# Altium schematic sheet Power_Supply.SchDoc
size A4; CompanyName: Technische Hochschule Nürnberg Georg Simon Ohm; Address1: Fürther Straße 250; Address2: 90429 Nürnberg; Address3: GERMANY; SheetNumber: 3; SheetTotal: 3; CompanyName2: Institut ELSYS
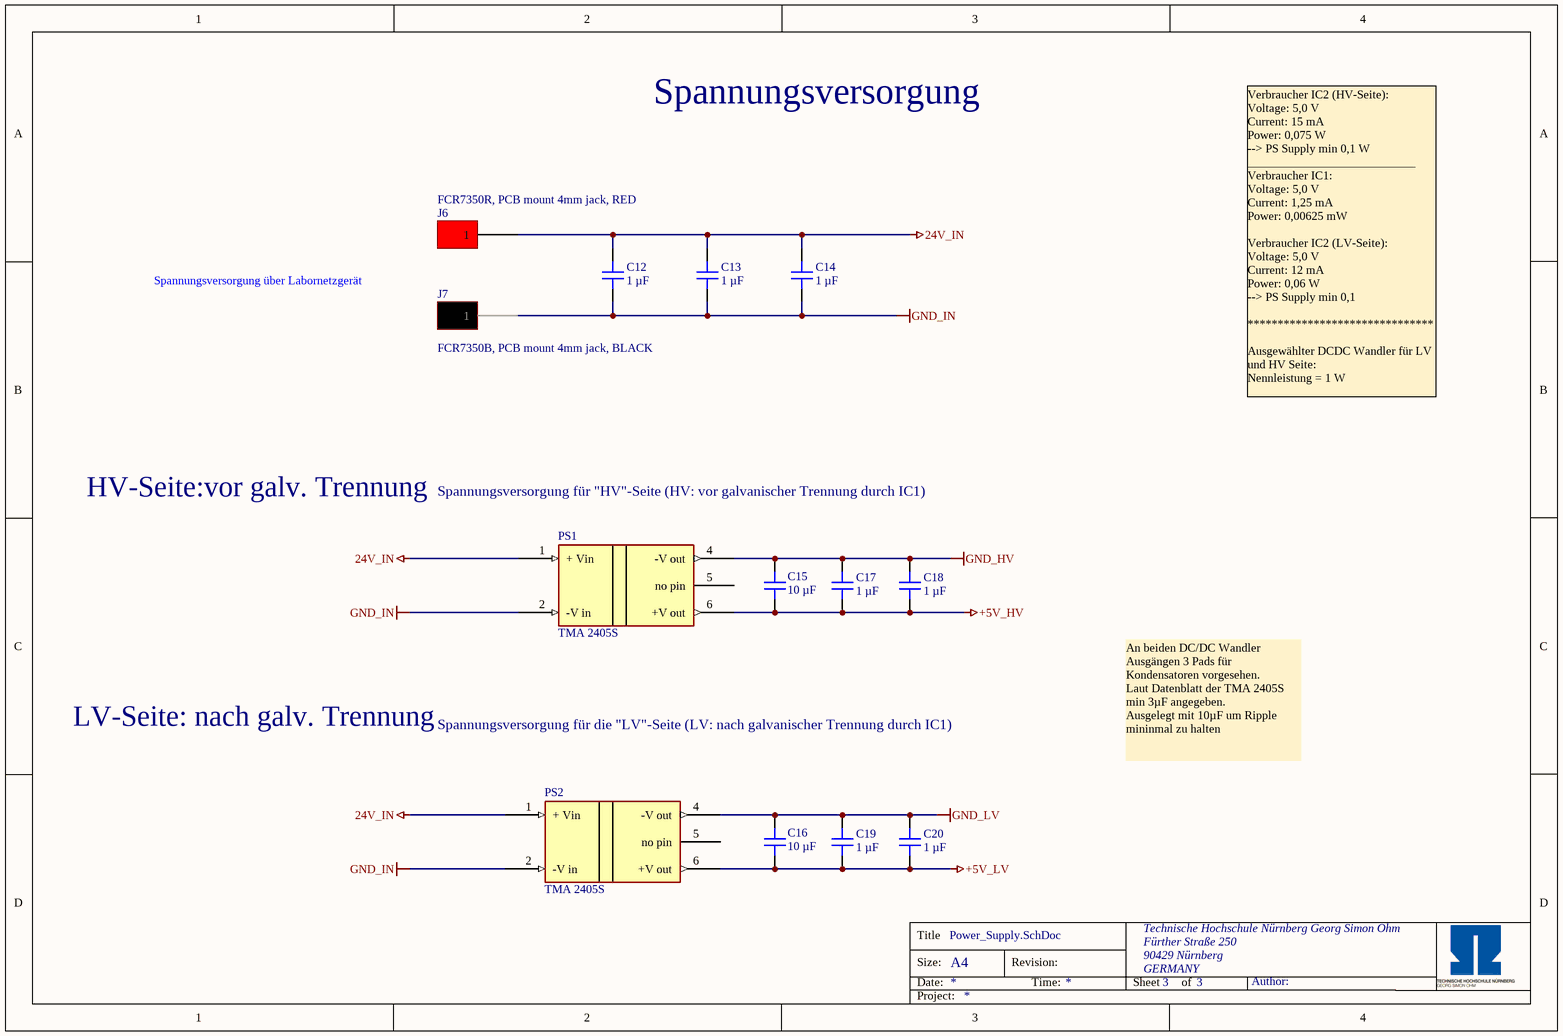
[diagram p0: Power_Supply.SchDoc]

## Parts
C12  1 µF  [C_0603]
C13  1 µF  [C_0603]
C14  1 µF  [C_0603]
C15  10 µF  [C_0603]
C16  10 µF  [C_0603]
C17  1 µF  [C_0603]
C18  1 µF  [C_0603]
C19  1 µF  [C_0603]
C20  1 µF  [C_0603]
J6  FCR7350R, PCB mount 4mm jack, RED  [FCR7350]
J7  FCR7350B, PCB mount 4mm jack, BLACK  [FCR7350]
PS1  TMA 2405S  [TMA 2405D]
PS2  TMA 2405S  [TMA 2405D]

## Nets
24V_IN: C12.1 C13.1 C14.1 J6.1 PS1.1(+_Vin) PS2.1(+_Vin)
+5V_HV: C15.1 C17.1 C18.1 PS1.6(+V_out)
+5V_LV: C16.1 C19.1 C20.1 PS2.6(+V_out)
GND_HV: C15.2 C17.2 C18.2 PS1.4(-V_out)
GND_IN: C12.2 C13.2 C14.2 J7.1 PS1.2(-V_in) PS2.2(-V_in)
GND_LV: C16.2 C19.2 C20.2 PS2.4(-V_out)

Not connected (* = marked no-connect by the designer): PS1 5(no_pin); PS2 5(no_pin)

## Notes on the sheet
- Spannungsversorgung
- Spannungsversorgung über Labornetzgerät
- Verbraucher IC2 (HV-Seite):
  Voltage: 5,0 V
  Current: 15 mA
  Power: 0,075 W
  --> PS Supply min 0,1 W
  ____________________________
  Verbraucher IC1:
  Voltage: 5,0 V
  Current: 1,25 mA
  Power: 0,00625 mW
  Verbraucher IC2 (LV-Seite):
  Voltage: 5,0 V
  Current: 12 mA
  Power: 0,06 W
  --> PS Supply min 0,1
  *******************************
  Ausgewählter DCDC Wandler für LV und HV Seite:
  Nennleistung = 1 W
- HV-Seite:vor galv. Trennung
- Spannungsversorgung für "HV"-Seite (HV: vor galvanischer Trennung durch IC1)
- LV-Seite: nach galv. Trennung
- Spannungsversorgung für die "LV"-Seite (LV: nach galvanischer Trennung durch IC1)
- An beiden DC/DC Wandler Ausgängen 3 Pads für Kondensatoren vorgesehen.
  Laut Datenblatt der TMA 2405S min 3µF angegeben.
  Ausgelegt mit 10µF um Ripple mininmal zu halten
- Title
- Size:
- Date:
- A4
- Revision:
- Time:
- Sheet
- of
- Author:
- Project:

## Library data of the parts
C12-C14 C17-C20 = CL10A105KB8NNNC: 50V 1uF X5R ±10% 0603  Multilayer Ceramic Capacitors MLCC - SMD/SMT ROHS; Manufacturer: Samsung Electro-Mechanics; Voltage Rating: 50 VDC; Created from: MGremer; Manufacturer Part Number: CL10A105KB8NNNC; Value: 1 µF; PartID: 5; Created On: 20.12.2020 13:54:13; ComponentLink1Description: Datasheet; ComponentLink1URL: https://datasheet.lcsc.com/lcsc/1810261812_Samsung-Electro-Mechanics-CL10A105KB8NNNC_C15849.pdf; Component Type: Capacitor 0603; Device Package: 0603; Last Updated: 28.11.2022 17:23:01; Mounting Type: SMD; Operating Temperature: -55 - 85°C; Series: M; Type: Capacitor; Tolerance: 10 %; Live Cycle Status: 1; LCSC Part Number: C15849; Stock number: Labor SMD Container
  C12-C14: Supplier 1: LCSC; Supplier Part Number 1: C15849
  C17-C20: Supplier 1: Mouser; Supplier Part Number 1: 187-CL10A105KB8NNNC
C15 C16 = CL10A106MO8NQNC: Capacitor 0603, 16 VDC, 10 µF, X5R; Manufacturer: Samsung Electro-Mechanics; Tolerance: 20 %; Voltage Rating: 16 VDC; Created from: AGeiger; Manufacturer Part Number: CL10A106MO8NQNC; PartID: 101; Created On: 22.08.2022 13:56:44; ComponentLink1Description: Datasheet; ComponentLink1URL: https://datasheet.lcsc.com/lcsc/1810261909_Samsung-Electro-Mechanics-CL10A106MO8NQNC_C92487.pdf; Component Type: Capacitor 0603; Device Package: 0603; Last Updated: 03.09.2022 10:50:43; Mounting Type: SMD; Operating Temperature: -55 - 85°C; Series: X5R; Type: Capacitor; Value: 10 µF; Live Cycle Status: 1; LCSC Part Number: C92487
  C15: Supplier 1: Mouser; Supplier Part Number 1: 187-CL10A106MO8NQNC
  C16: Supplier 1: Rs; Supplier Part Number 1: 7882893P
J6 = FCR7350R: FCR7350B, 1000V, 24A, RED; Manufacturer: Cliff; Value: PCB mount 4mm jack, Red FCR7350R, 1000V, 24A; Created from: DHufnagel; Manufacturer Part Number: FCR7350R; PartID: 7; Created On: 13.06.2022 10:18:11; ComponentLink1Description: datasheet; ComponentLink1URL: https://www.cliffuk.co.uk/products/testleads/sockets/S16NPC.pdf; ComponentLink2Description: drawing; ComponentLink2URL: https://media.digikey.com/pdf/Data%20Sheets/Cliff%20Electronic%20LTD%20PDF's/FCR7350_Drawing.pdf; Component Type: PCB mount 4mm jack, Red; Device Package: THT; Last Updated: 28.06.2022 13:58:37; Minimum Order: 1; Mounting Type: THT; Operating Temperature: -40°C - 80°C; Series: S16N-PC; Supplier 1: Digi-Key; Supplier Part Number 1: 3185-FCR7350R-ND; Supplier 2: farnell; Supplier Part Number 2: 1854508; Type: PCB mount 4mm jack, Red FCR7350R, 1000V, 24A; Live Cycle Status: 1; Stock number: not stored
J7 = FCR7350B: FCR7350B, 1000V, 24A, BLACK; Manufacturer: Cliff; Value: PCB mount 4mm jack, Black	FCR7350B, 1000V, 24A; Created from: DHufnagel; Manufacturer Part Number: FCR7350B; PartID: 6; Created On: 13.06.2022 10:18:11; ComponentLink1Description: datasheet; ComponentLink1URL: https://www.cliffuk.co.uk/products/testleads/sockets/S16NPC.pdf; ComponentLink2Description: drawing; ComponentLink2URL: https://media.digikey.com/pdf/Data%20Sheets/Cliff%20Electronic%20LTD%20PDF's/FCR7350_Drawing.pdf; Component Type: PCB mount 4mm jack, Black; Device Package: THT; Last Updated: 28.06.2022 13:58:37; Minimum Order: 1; Mounting Type: THT; Operating Temperature: -40°C - 80°C; Series: S16N-PC; Supplier 1: Digi-Key; Supplier Part Number 1: 3185-FCR7350B-ND; Supplier 2: farnell; Supplier Part Number 2: 1854507; Type: PCB mount 4mm jack, Black	FCR7350B, 1000V, 24A; Live Cycle Status: 1; Stock number: not stored
PS1 PS2 = TMA 2405S: Isolierte DC/DC-Wandler – Durchsteckmontage Product Type: DC/DC; Package Style: SIP; Output Power (W): 1; Input Voltage: 24 VDC +/-10%; Output 1 (Vdc): 5;; Parameter 1: *; Supplier 1: Mouser; Supplier Part Number 1: 495-TMA-2405S